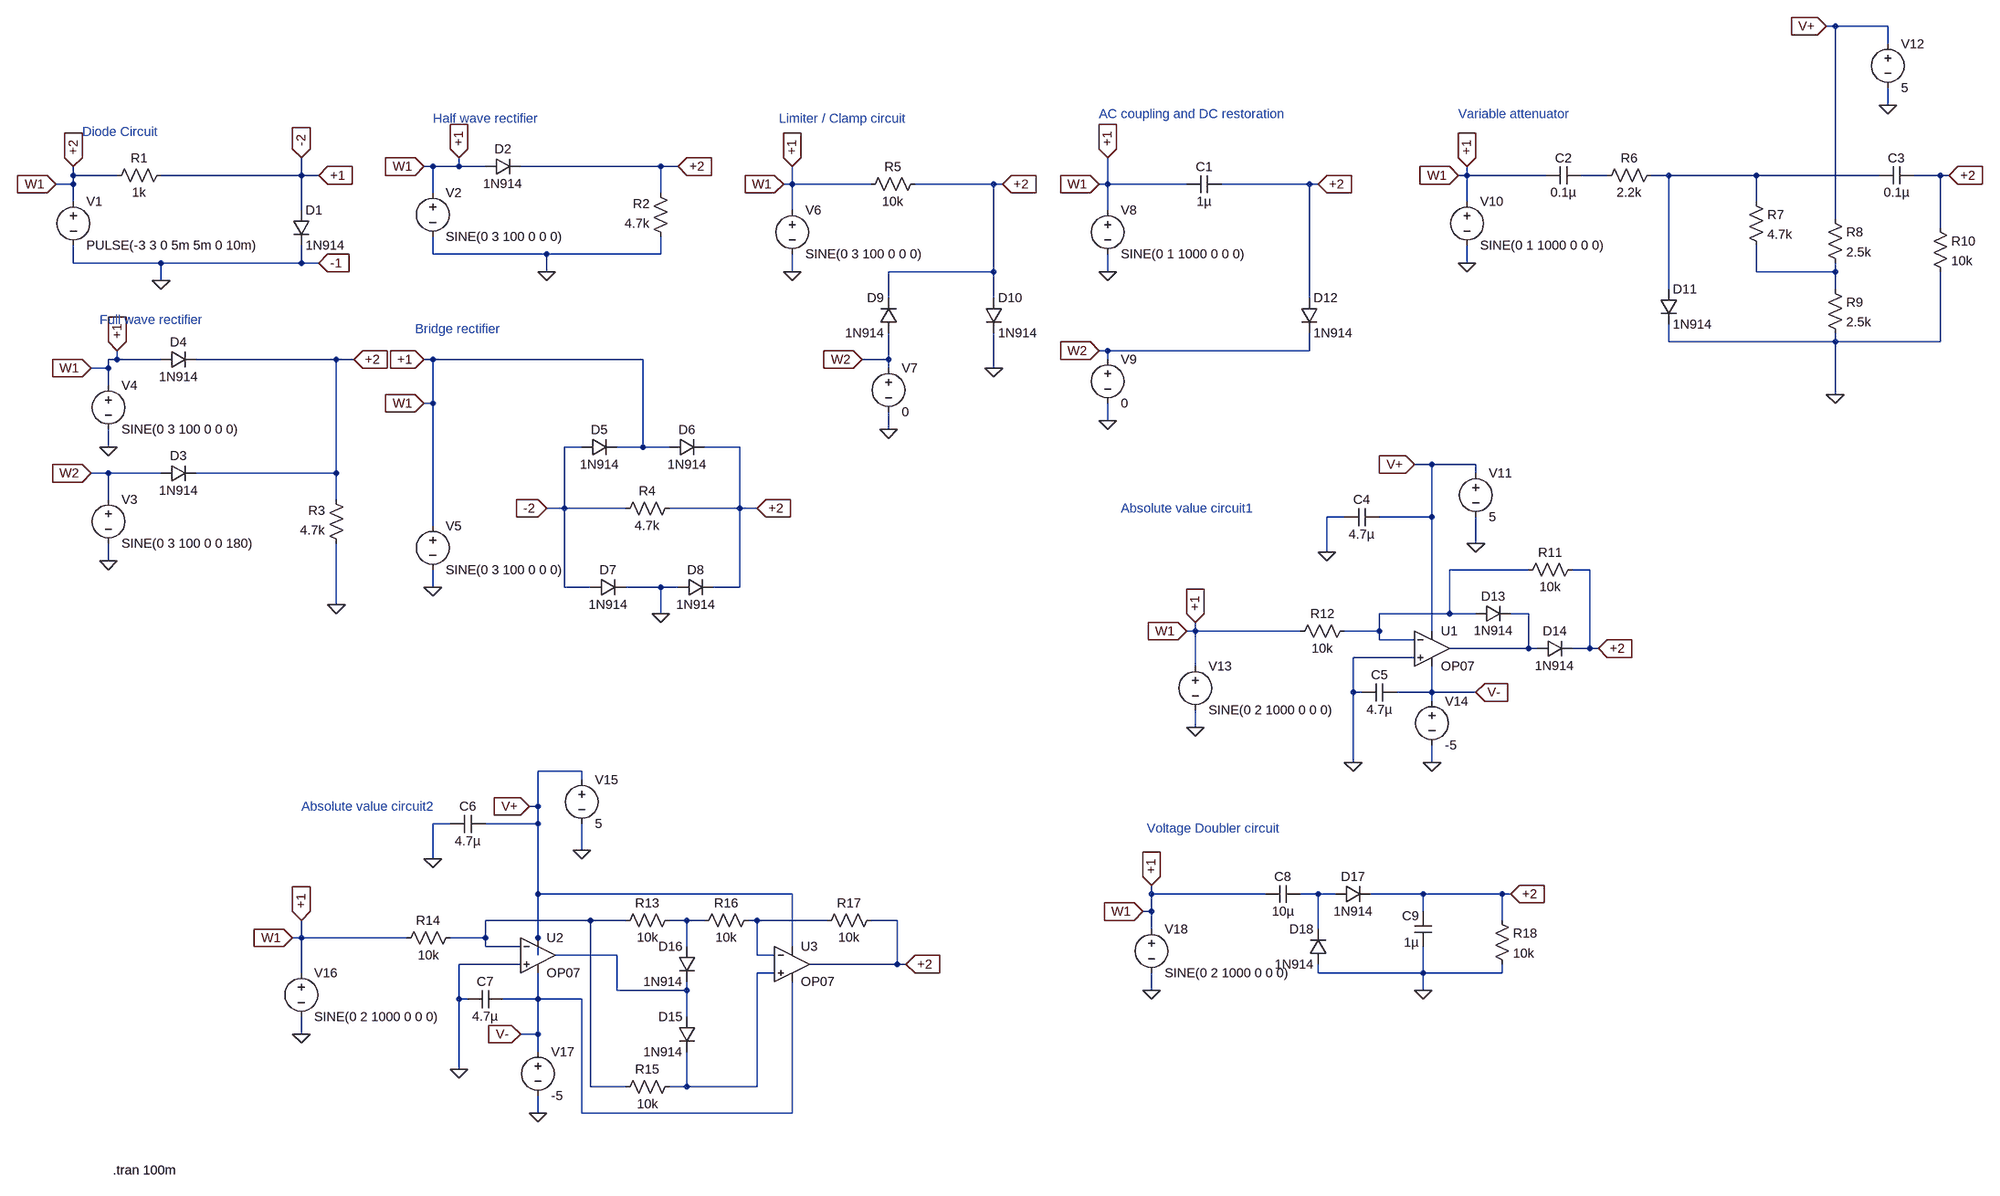
[diagram p0: schematic diode_ltspice.asc]
diode_ltspice.asc, the LTspice schematic file:
Version 4
SHEET 1 3192 728
WIRE 2896 -1376 2880 -1376
WIRE 2992 -1376 2896 -1376
WIRE 2992 -1344 2992 -1376
WIRE 2992 -1232 2992 -1264
WIRE 336 -1120 320 -1120
WIRE 384 -1120 384 -1136
WIRE 384 -1120 336 -1120
WIRE 432 -1120 384 -1120
WIRE 752 -1120 496 -1120
WIRE 784 -1120 752 -1120
WIRE -320 -1104 -320 -1120
WIRE -240 -1104 -320 -1104
WIRE 96 -1104 96 -1136
WIRE 96 -1104 -160 -1104
WIRE 128 -1104 96 -1104
WIRE 2224 -1104 2224 -1120
WIRE 2224 -1104 2208 -1104
WIRE 2368 -1104 2224 -1104
WIRE 2480 -1104 2432 -1104
WIRE 2592 -1104 2560 -1104
WIRE 2752 -1104 2592 -1104
WIRE 2976 -1104 2752 -1104
WIRE 3088 -1104 3040 -1104
WIRE 3104 -1104 3088 -1104
WIRE -320 -1088 -320 -1104
WIRE -320 -1088 -352 -1088
WIRE 992 -1088 992 -1120
WIRE 992 -1088 976 -1088
WIRE 1136 -1088 992 -1088
WIRE 1360 -1088 1216 -1088
WIRE 1376 -1088 1360 -1088
WIRE 1568 -1088 1568 -1136
WIRE 1568 -1088 1552 -1088
WIRE 1712 -1088 1568 -1088
WIRE 1936 -1088 1776 -1088
WIRE 1952 -1088 1936 -1088
WIRE 336 -1072 336 -1120
WIRE 752 -1072 752 -1120
WIRE -320 -1056 -320 -1088
WIRE 2224 -1056 2224 -1104
WIRE 2752 -1056 2752 -1104
WIRE 96 -1040 96 -1104
WIRE 992 -1040 992 -1088
WIRE 1568 -1040 1568 -1088
WIRE 2896 -1024 2896 -1376
WIRE 3088 -1008 3088 -1104
WIRE 336 -960 336 -992
WIRE 544 -960 336 -960
WIRE 752 -960 752 -992
WIRE 752 -960 544 -960
WIRE -320 -944 -320 -976
WIRE -160 -944 -320 -944
WIRE 96 -944 96 -976
WIRE 96 -944 -160 -944
WIRE 128 -944 96 -944
WIRE 2224 -944 2224 -976
WIRE 544 -928 544 -960
WIRE 992 -928 992 -960
WIRE 1360 -928 1360 -1088
WIRE 1360 -928 1168 -928
WIRE 1568 -928 1568 -960
WIRE 2752 -928 2752 -976
WIRE 2896 -928 2896 -944
WIRE 2896 -928 2752 -928
WIRE -160 -912 -160 -944
WIRE 2592 -896 2592 -1104
WIRE 2896 -896 2896 -928
WIRE 1168 -880 1168 -928
WIRE 1360 -880 1360 -928
WIRE 1936 -880 1936 -1088
WIRE 2592 -800 2592 -832
WIRE 2896 -800 2896 -816
WIRE 2896 -800 2592 -800
WIRE 3088 -800 3088 -928
WIRE 3088 -800 2896 -800
WIRE 1568 -784 1552 -784
WIRE 1936 -784 1936 -816
WIRE 1936 -784 1568 -784
WIRE -240 -768 -240 -784
WIRE -240 -768 -256 -768
WIRE -160 -768 -240 -768
WIRE 160 -768 -96 -768
WIRE 192 -768 160 -768
WIRE 336 -768 320 -768
WIRE 720 -768 336 -768
WIRE 1168 -768 1168 -816
WIRE 1168 -768 1120 -768
WIRE 1568 -768 1568 -784
WIRE -256 -752 -256 -768
WIRE -256 -752 -288 -752
WIRE 1168 -752 1168 -768
WIRE 1360 -752 1360 -816
WIRE -256 -720 -256 -752
WIRE 2896 -704 2896 -800
WIRE 336 -688 336 -768
WIRE 336 -688 320 -688
WIRE 1568 -656 1568 -688
WIRE 1168 -640 1168 -672
WIRE -256 -608 -256 -640
WIRE 608 -608 576 -608
WIRE 720 -608 720 -768
WIRE 720 -608 672 -608
WIRE 768 -608 720 -608
WIRE 896 -608 832 -608
WIRE 2160 -576 2128 -576
WIRE 2240 -576 2160 -576
WIRE -256 -560 -288 -560
WIRE -160 -560 -256 -560
WIRE 160 -560 160 -768
WIRE 160 -560 -96 -560
WIRE 2240 -560 2240 -576
WIRE -256 -512 -256 -560
WIRE 160 -512 160 -560
WIRE 576 -496 576 -608
WIRE 576 -496 544 -496
WIRE 688 -496 576 -496
WIRE 896 -496 896 -608
WIRE 896 -496 768 -496
WIRE 928 -496 896 -496
WIRE 2000 -480 1968 -480
WIRE 2160 -480 2160 -576
WIRE 2160 -480 2064 -480
WIRE 336 -464 336 -688
WIRE 2240 -432 2240 -480
WIRE 1968 -416 1968 -480
WIRE -256 -400 -256 -432
WIRE 2336 -384 2192 -384
WIRE 2448 -384 2416 -384
WIRE 336 -352 336 -384
WIRE 576 -352 576 -496
WIRE 624 -352 576 -352
WIRE 752 -352 688 -352
WIRE 784 -352 752 -352
WIRE 896 -352 896 -496
WIRE 896 -352 848 -352
WIRE 160 -320 160 -432
WIRE 752 -304 752 -352
WIRE 2192 -304 2192 -384
WIRE 2192 -304 2064 -304
WIRE 2240 -304 2192 -304
WIRE 2336 -304 2304 -304
WIRE 1728 -272 1728 -288
WIRE 1728 -272 1712 -272
WIRE 1920 -272 1728 -272
WIRE 2064 -272 2064 -304
WIRE 2064 -272 2000 -272
WIRE 2160 -272 2160 -480
WIRE 2064 -256 2064 -272
WIRE 2128 -256 2064 -256
WIRE 2336 -240 2336 -304
WIRE 2336 -240 2192 -240
WIRE 2352 -240 2336 -240
WIRE 2448 -240 2448 -384
WIRE 2448 -240 2416 -240
WIRE 2464 -240 2448 -240
WIRE 2128 -224 2016 -224
WIRE 1728 -208 1728 -272
WIRE 2016 -160 2016 -224
WIRE 2032 -160 2016 -160
WIRE 2160 -160 2160 -208
WIRE 2160 -160 2096 -160
WIRE 2240 -160 2160 -160
WIRE 2160 -144 2160 -160
WIRE 1728 -96 1728 -128
WIRE 2016 -32 2016 -160
WIRE 2160 -32 2160 -64
WIRE 608 -16 528 -16
WIRE 608 0 608 -16
WIRE 528 48 528 -16
WIRE 528 48 512 48
WIRE 368 80 336 80
WIRE 528 80 528 48
WIRE 528 80 432 80
WIRE 608 128 608 80
WIRE 336 144 336 80
WIRE 528 208 528 80
WIRE 992 208 528 208
WIRE 1648 208 1648 192
WIRE 1856 208 1648 208
WIRE 1952 208 1920 208
WIRE 1984 208 1952 208
WIRE 2144 208 2048 208
WIRE 2288 208 2144 208
WIRE 2304 208 2288 208
WIRE 1648 240 1648 208
WIRE 1648 240 1632 240
WIRE 2144 240 2144 208
WIRE 624 256 432 256
WIRE 688 256 624 256
WIRE 800 256 768 256
WIRE 832 256 800 256
WIRE 928 256 912 256
WIRE 1056 256 928 256
WIRE 1184 256 1136 256
WIRE 2288 256 2288 208
WIRE 1648 272 1648 240
WIRE 1952 272 1952 208
WIRE 96 288 96 256
WIRE 96 288 80 288
WIRE 288 288 96 288
WIRE 432 288 432 256
WIRE 432 288 368 288
WIRE 528 288 528 208
WIRE 432 304 432 288
WIRE 496 304 432 304
WIRE 800 304 800 256
WIRE 992 304 992 208
WIRE 528 320 528 288
WIRE 672 320 560 320
WIRE 928 320 928 256
WIRE 960 320 928 320
WIRE 496 336 384 336
WIRE 1184 336 1184 256
WIRE 1184 336 1024 336
WIRE 1200 336 1184 336
WIRE 96 352 96 288
WIRE 960 352 928 352
WIRE 1952 352 1952 336
WIRE 2144 352 2144 304
WIRE 2144 352 1952 352
WIRE 2288 352 2288 336
WIRE 2288 352 2144 352
WIRE 672 384 672 320
WIRE 800 384 800 368
WIRE 800 384 672 384
WIRE 1648 384 1648 352
WIRE 2144 384 2144 352
WIRE 384 400 384 336
WIRE 400 400 384 400
WIRE 528 400 528 352
WIRE 528 400 464 400
WIRE 608 400 528 400
WIRE 800 432 800 384
WIRE 96 464 96 432
WIRE 528 464 528 400
WIRE 528 464 496 464
WIRE 528 496 528 464
WIRE 384 528 384 400
WIRE 624 560 624 256
WIRE 688 560 624 560
WIRE 800 560 800 496
WIRE 800 560 768 560
WIRE 928 560 928 352
WIRE 928 560 800 560
WIRE 528 608 528 576
WIRE 608 608 608 400
WIRE 992 608 992 368
WIRE 992 608 608 608
FLAG -160 -912 0
FLAG 544 -928 0
FLAG 160 -320 0
FLAG -256 -608 0
FLAG -256 -400 0
FLAG 752 -304 0
FLAG 336 -352 0
FLAG 1360 -752 0
FLAG 992 -928 0
FLAG 1168 -640 0
FLAG 1568 -928 0
FLAG 1568 -656 0
FLAG 2224 -944 0
FLAG 2992 -1232 0
FLAG 2896 -704 0
FLAG 2240 -432 0
FLAG 1968 -416 0
FLAG 1728 -96 0
FLAG 2160 -32 0
FLAG 2016 -32 0
FLAG 608 128 0
FLAG 336 144 0
FLAG 96 464 0
FLAG 528 608 0
FLAG 384 528 0
FLAG 1648 384 0
FLAG 2144 384 0
FLAG -320 -1120 +2
IOPIN -320 -1120 In
FLAG 96 -1136 -2
IOPIN 96 -1136 In
FLAG 128 -1104 +1
IOPIN 128 -1104 In
FLAG 128 -944 -1
IOPIN 128 -944 In
FLAG -352 -1088 W1
IOPIN -352 -1088 In
FLAG 320 -1120 W1
IOPIN 320 -1120 In
FLAG 384 -1136 +1
IOPIN 384 -1136 In
FLAG 784 -1120 +2
IOPIN 784 -1120 In
FLAG -240 -784 +1
IOPIN -240 -784 In
FLAG -288 -752 W1
IOPIN -288 -752 In
FLAG 192 -768 +2
IOPIN 192 -768 In
FLAG -288 -560 W2
IOPIN -288 -560 In
FLAG 320 -768 +1
IOPIN 320 -768 In
FLAG 544 -496 -2
IOPIN 544 -496 In
FLAG 928 -496 +2
IOPIN 928 -496 In
FLAG 320 -688 W1
IOPIN 320 -688 In
FLAG 976 -1088 W1
IOPIN 976 -1088 In
FLAG 992 -1120 +1
IOPIN 992 -1120 In
FLAG 1376 -1088 +2
IOPIN 1376 -1088 In
FLAG 1120 -768 W2
IOPIN 1120 -768 In
FLAG 1552 -1088 W1
IOPIN 1552 -1088 In
FLAG 1552 -784 W2
IOPIN 1552 -784 In
FLAG 1568 -1136 +1
IOPIN 1568 -1136 In
FLAG 1952 -1088 +2
IOPIN 1952 -1088 In
FLAG 2208 -1104 W1
IOPIN 2208 -1104 In
FLAG 2224 -1120 +1
IOPIN 2224 -1120 In
FLAG 2880 -1376 V+
IOPIN 2880 -1376 In
FLAG 3104 -1104 +2
IOPIN 3104 -1104 In
FLAG 1712 -272 W1
IOPIN 1712 -272 In
FLAG 1728 -288 +1
IOPIN 1728 -288 In
FLAG 2128 -576 V+
IOPIN 2128 -576 In
FLAG 2464 -240 +2
IOPIN 2464 -240 In
FLAG 2240 -160 V-
IOPIN 2240 -160 In
FLAG 512 48 V+
IOPIN 512 48 In
FLAG 496 464 V-
IOPIN 496 464 In
FLAG 80 288 W1
IOPIN 80 288 In
FLAG 96 256 +1
IOPIN 96 256 In
FLAG 1200 336 +2
IOPIN 1200 336 In
FLAG 2304 208 +2
IOPIN 2304 208 In
FLAG 1648 192 +1
IOPIN 1648 192 In
FLAG 1632 240 W1
IOPIN 1632 240 In
SYMBOL diode 80 -1040 R0
SYMATTR InstName D1
SYMATTR Value 1N914
SYMBOL res -144 -1120 R90
WINDOW 0 0 56 VBottom 2
WINDOW 3 32 56 VTop 2
SYMATTR InstName R1
SYMATTR Value 1k
SYMBOL voltage -320 -1072 R0
WINDOW 123 0 0 Left 0
WINDOW 39 0 0 Left 0
SYMATTR InstName V1
SYMATTR Value PULSE(-3 3 0 5m 5m 0 10m)
SYMBOL diode 432 -1104 R270
WINDOW 0 32 32 VTop 2
WINDOW 3 0 32 VBottom 2
SYMATTR InstName D2
SYMATTR Value 1N914
SYMBOL res 768 -976 R180
WINDOW 0 36 76 Left 2
WINDOW 3 36 40 Left 2
SYMATTR InstName R2
SYMATTR Value 4.7k
SYMBOL voltage 336 -1088 R0
WINDOW 123 0 0 Left 0
WINDOW 39 0 0 Left 0
SYMATTR InstName V2
SYMATTR Value SINE(0 3 100 0 0 0)
SYMBOL diode -160 -544 R270
WINDOW 0 32 32 VTop 2
WINDOW 3 0 32 VBottom 2
SYMATTR InstName D3
SYMATTR Value 1N914
SYMBOL res 176 -416 R180
WINDOW 0 36 76 Left 2
WINDOW 3 36 40 Left 2
SYMATTR InstName R3
SYMATTR Value 4.7k
SYMBOL voltage -256 -528 R0
WINDOW 123 0 0 Left 0
WINDOW 39 0 0 Left 0
SYMATTR InstName V3
SYMATTR Value SINE(0 3 100 0 0 180)
SYMBOL diode -160 -752 R270
WINDOW 0 32 32 VTop 2
WINDOW 3 0 32 VBottom 2
SYMATTR InstName D4
SYMATTR Value 1N914
SYMBOL voltage -256 -736 R0
WINDOW 123 0 0 Left 0
WINDOW 39 0 0 Left 0
SYMATTR InstName V4
SYMATTR Value SINE(0 3 100 0 0 0)
SYMBOL diode 608 -592 R270
WINDOW 0 32 32 VTop 2
WINDOW 3 0 32 VBottom 2
SYMATTR InstName D5
SYMATTR Value 1N914
SYMBOL res 672 -480 R270
WINDOW 0 32 56 VTop 2
WINDOW 3 0 56 VBottom 2
SYMATTR InstName R4
SYMATTR Value 4.7k
SYMBOL voltage 336 -480 R0
WINDOW 123 0 0 Left 0
WINDOW 39 0 0 Left 0
SYMATTR InstName V5
SYMATTR Value SINE(0 3 100 0 0 0)
SYMBOL diode 768 -592 R270
WINDOW 0 32 32 VTop 2
WINDOW 3 0 32 VBottom 2
SYMATTR InstName D6
SYMATTR Value 1N914
SYMBOL diode 624 -336 R270
WINDOW 0 32 32 VTop 2
WINDOW 3 0 32 VBottom 2
SYMATTR InstName D7
SYMATTR Value 1N914
SYMBOL diode 784 -336 R270
WINDOW 0 32 32 VTop 2
WINDOW 3 0 32 VBottom 2
SYMATTR InstName D8
SYMATTR Value 1N914
SYMBOL res 1232 -1104 R90
WINDOW 0 0 56 VBottom 2
WINDOW 3 32 56 VTop 2
SYMATTR InstName R5
SYMATTR Value 10k
SYMBOL diode 1184 -816 R180
WINDOW 0 24 64 Left 2
WINDOW 3 24 0 Left 2
SYMATTR InstName D9
SYMATTR Value 1N914
SYMBOL diode 1344 -880 R0
SYMATTR InstName D10
SYMATTR Value 1N914
SYMBOL voltage 992 -1056 R0
WINDOW 123 0 0 Left 0
WINDOW 39 0 0 Left 0
SYMATTR InstName V6
SYMATTR Value SINE(0 3 100 0 0 0)
SYMBOL voltage 1168 -768 R0
WINDOW 123 0 0 Left 0
WINDOW 39 0 0 Left 0
SYMATTR InstName V7
SYMATTR Value 0
SYMBOL diode 1920 -880 R0
SYMATTR InstName D12
SYMATTR Value 1N914
SYMBOL voltage 1568 -1056 R0
WINDOW 123 0 0 Left 0
WINDOW 39 0 0 Left 0
SYMATTR InstName V8
SYMATTR Value SINE(0 1 1000 0 0 0)
SYMBOL cap 1776 -1104 R90
WINDOW 0 0 32 VBottom 2
WINDOW 3 32 32 VTop 2
SYMATTR InstName C1
SYMATTR Value 1µ
SYMBOL voltage 1568 -784 R0
WINDOW 123 0 0 Left 0
WINDOW 39 0 0 Left 0
SYMATTR InstName V9
SYMATTR Value 0
SYMBOL diode 2576 -896 R0
SYMATTR InstName D11
SYMATTR Value 1N914
SYMBOL voltage 2224 -1072 R0
WINDOW 123 0 0 Left 0
WINDOW 39 0 0 Left 0
SYMATTR InstName V10
SYMATTR Value SINE(0 1 1000 0 0 0)
SYMBOL cap 2432 -1120 R90
WINDOW 0 0 32 VBottom 2
WINDOW 3 32 32 VTop 2
SYMATTR InstName C2
SYMATTR Value 0.1µ
SYMBOL res 2576 -1120 R90
WINDOW 0 0 56 VBottom 2
WINDOW 3 32 56 VTop 2
SYMATTR InstName R6
SYMATTR Value 2.2k
SYMBOL res 2736 -1072 R0
SYMATTR InstName R7
SYMATTR Value 4.7k
SYMBOL res 2880 -1040 R0
SYMATTR InstName R8
SYMATTR Value 2.5k
SYMBOL res 2880 -912 R0
SYMATTR InstName R9
SYMATTR Value 2.5k
SYMBOL voltage 2992 -1360 R0
WINDOW 123 0 0 Left 0
WINDOW 39 0 0 Left 0
SYMATTR InstName V12
SYMATTR Value 5
SYMBOL cap 3040 -1120 R90
WINDOW 0 0 32 VBottom 2
WINDOW 3 32 32 VTop 2
SYMATTR InstName C3
SYMATTR Value 0.1µ
SYMBOL res 3072 -1024 R0
SYMATTR InstName R10
SYMATTR Value 10k
SYMBOL voltage 2240 -576 R0
WINDOW 123 0 0 Left 0
WINDOW 39 0 0 Left 0
SYMATTR InstName V11
SYMATTR Value 5
SYMBOL Opamps\\OP07 2160 -304 R0
SYMATTR InstName U1
SYMBOL cap 2064 -496 R90
WINDOW 0 0 32 VBottom 2
WINDOW 3 32 32 VTop 2
SYMATTR InstName C4
SYMATTR Value 4.7µ
SYMBOL diode 2240 -288 R270
WINDOW 0 32 32 VTop 2
WINDOW 3 0 32 VBottom 2
SYMATTR InstName D13
SYMATTR Value 1N914
SYMBOL res 2432 -400 R90
WINDOW 0 0 56 VBottom 2
WINDOW 3 32 56 VTop 2
SYMATTR InstName R11
SYMATTR Value 10k
SYMBOL res 2016 -288 R90
WINDOW 0 0 56 VBottom 2
WINDOW 3 32 56 VTop 2
SYMATTR InstName R12
SYMATTR Value 10k
SYMBOL voltage 1728 -224 R0
WINDOW 123 0 0 Left 0
WINDOW 39 0 0 Left 0
SYMATTR InstName V13
SYMATTR Value SINE(0 2 1000 0 0 0)
SYMBOL voltage 2160 -160 R0
WINDOW 123 0 0 Left 0
WINDOW 39 0 0 Left 0
SYMATTR InstName V14
SYMATTR Value -5
SYMBOL cap 2096 -176 R90
WINDOW 0 0 32 VBottom 2
WINDOW 3 32 32 VTop 2
SYMATTR InstName C5
SYMATTR Value 4.7µ
SYMBOL diode 2352 -256 M90
WINDOW 0 0 32 VBottom 2
WINDOW 3 32 32 VTop 2
SYMATTR InstName D14
SYMATTR Value 1N914
SYMBOL voltage 608 -16 R0
WINDOW 123 0 0 Left 0
WINDOW 39 0 0 Left 0
SYMATTR InstName V15
SYMATTR Value 5
SYMBOL Opamps\\OP07 528 256 R0
SYMATTR InstName U2
SYMBOL cap 432 64 R90
WINDOW 0 0 32 VBottom 2
WINDOW 3 32 32 VTop 2
SYMATTR InstName C6
SYMATTR Value 4.7µ
SYMBOL res 784 240 R90
WINDOW 0 0 56 VBottom 2
WINDOW 3 32 56 VTop 2
SYMATTR InstName R13
SYMATTR Value 10k
SYMBOL res 384 272 R90
WINDOW 0 0 56 VBottom 2
WINDOW 3 32 56 VTop 2
SYMATTR InstName R14
SYMATTR Value 10k
SYMBOL voltage 96 336 R0
WINDOW 123 0 0 Left 0
WINDOW 39 0 0 Left 0
SYMATTR InstName V16
SYMATTR Value SINE(0 2 1000 0 0 0)
SYMBOL voltage 528 480 R0
WINDOW 123 0 0 Left 0
WINDOW 39 0 0 Left 0
SYMATTR InstName V17
SYMATTR Value -5
SYMBOL cap 464 384 R90
WINDOW 0 0 32 VBottom 2
WINDOW 3 32 32 VTop 2
SYMATTR InstName C7
SYMATTR Value 4.7µ
SYMBOL diode 816 304 M0
SYMATTR InstName D16
SYMATTR Value 1N914
SYMBOL diode 816 432 M0
SYMATTR InstName D15
SYMATTR Value 1N914
SYMBOL res 784 544 R90
WINDOW 0 0 56 VBottom 2
WINDOW 3 32 56 VTop 2
SYMATTR InstName R15
SYMATTR Value 10k
SYMBOL res 928 240 R90
WINDOW 0 0 56 VBottom 2
WINDOW 3 32 56 VTop 2
SYMATTR InstName R16
SYMATTR Value 10k
SYMBOL Opamps\\OP07 992 272 R0
SYMATTR InstName U3
SYMBOL res 1152 240 R90
WINDOW 0 0 56 VBottom 2
WINDOW 3 32 56 VTop 2
SYMATTR InstName R17
SYMATTR Value 10k
SYMBOL cap 1920 192 R90
WINDOW 0 0 32 VBottom 2
WINDOW 3 32 32 VTop 2
SYMATTR InstName C8
SYMATTR Value 10µ
SYMBOL cap 2160 304 R180
WINDOW 0 24 56 Left 2
WINDOW 3 24 8 Left 2
SYMATTR InstName C9
SYMATTR Value 1µ
SYMBOL diode 1984 224 R270
WINDOW 0 32 32 VTop 2
WINDOW 3 0 32 VBottom 2
SYMATTR InstName D17
SYMATTR Value 1N914
SYMBOL diode 1968 336 R180
WINDOW 0 24 64 Left 2
WINDOW 3 24 0 Left 2
SYMATTR InstName D18
SYMATTR Value 1N914
SYMBOL res 2272 240 R0
SYMATTR InstName R18
SYMATTR Value 10k
SYMBOL voltage 1648 256 R0
WINDOW 123 0 0 Left 0
WINDOW 39 0 0 Left 0
SYMATTR InstName V18
SYMATTR Value SINE(0 2 1000 0 0 0)
TEXT -248 712 Left 2 !.tran 100m
TEXT -304 -1184 Left 2 ;Diode Circuit
TEXT 336 -1208 Left 2 ;Half wave rectifier
TEXT -272 -840 Left 2 ;Full wave rectifier
TEXT 304 -824 Left 2 ;Bridge rectifier
TEXT 968 -1208 Left 2 ;Limiter / Clamp circuit
TEXT 1552 -1216 Left 2 ;AC coupling and DC restoration
TEXT 2208 -1216 Left 2 ;Variable attenuator
TEXT 1592 -496 Left 2 ;Absolute value circuit1
TEXT 96 48 Left 2 ;Absolute value circuit2
TEXT 1640 88 Left 2 ;Voltage Doubler circuit

The netlist it stands for:
* diode_ltspice.asc
D1 W1 0 1N914
R1 W1 W1 1k
V1 W1 0 PULSE(-3 3 0 5m 5m 0 10m)
D2 W1 W1 1N914
R2 0 W1 4.7k
V2 W1 0 SINE(0 3 100 0 0 0)
D3 W2 W1 1N914
R3 0 W1 4.7k
V3 W2 0 SINE(0 3 100 0 0 180)
D4 W1 W1 1N914
V4 W1 0 SINE(0 3 100 0 0 0)
D5 W1 W1 1N914
R4 W1 W1 4.7k
V5 W1 0 SINE(0 3 100 0 0 0)
D6 W1 W1 1N914
D7 W1 0 1N914
D8 0 W1 1N914
R5 W1 W1 10k
D9 W2 W1 1N914
D10 W1 0 1N914
V6 W1 0 SINE(0 3 100 0 0 0)
V7 W2 0 0
D12 W1 W2 1N914
V8 W1 0 SINE(0 1 1000 0 0 0)
C1 W1 W1 1µ
V9 W2 0 0
D11 N002 0 1N914
V10 W1 0 SINE(0 1 1000 0 0 0)
C2 N001 W1 0.1µ
R6 N002 N001 2.2k
R7 N002 N003 4.7k
R8 V+ N003 2.5k
R9 N003 0 2.5k
V12 V+ 0 5
C3 W1 N002 0.1µ
R10 W1 0 10k
V11 V+ 0 5
XU1 0 N004 V+ V- N005 LT1001  ; OP07, pins In+ In- V+ V- OUT
C4 V+ 0 4.7µ
D13 N004 N005 1N914
R11 W1 N004 10k
R12 N004 W1 10k
V13 W1 0 SINE(0 2 1000 0 0 0)
V14 V- 0 -5
C5 V- 0 4.7µ
D14 N005 W1 1N914
V15 V+ 0 5
XU2 0 N007 V+ V- N010 LT1001  ; OP07, pins In+ In- V+ V- OUT
C6 V+ 0 4.7µ
R13 N008 N007 10k
R14 N007 W1 10k
V16 W1 0 SINE(0 2 1000 0 0 0)
V17 V- 0 -5
C7 V- 0 4.7µ
D16 N008 N010 1N914
D15 N010 N011 1N914
R15 N011 N007 10k
R16 N009 N008 10k
XU3 N011 N009 V+ V- W1 LT1001  ; OP07, pins In+ In- V+ V- OUT
R17 W1 N009 10k
C8 N006 W1 10µ
C9 0 W1 1µ
D17 N006 W1 1N914
D18 0 N006 1N914
R18 W1 0 10k
V18 W1 0 SINE(0 2 1000 0 0 0)
.model D D
.lib standard.dio
.tran 100m
* Diode Circuit
* Half wave rectifier
* Full wave rectifier
* Bridge rectifier
* Limiter / Clamp circuit
* AC coupling and DC restoration
* Variable attenuator
* Absolute value circuit1
* Absolute value circuit2
* Voltage Doubler circuit
.lib LTC.lib
.backanno
.end